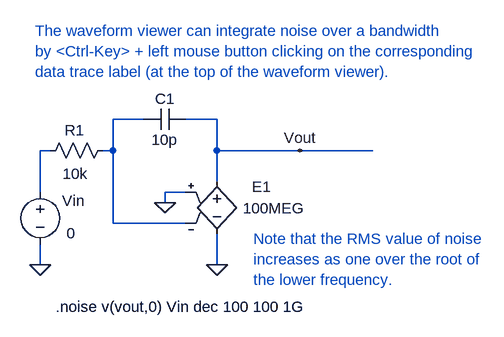
[diagram p0: schematic Ex8_14.asc]
Ex8_14.asc, the LTspice schematic file:
Version 4
SHEET 1 1084 704
WIRE 320 256 320 192
WIRE 320 368 320 336
WIRE 336 192 320 192
WIRE 432 192 416 192
WIRE 432 192 432 144
WIRE 432 304 432 192
WIRE 480 144 432 144
WIRE 512 272 512 256
WIRE 544 256 512 256
WIRE 544 304 432 304
WIRE 592 144 544 144
WIRE 592 192 592 144
WIRE 592 240 592 192
WIRE 592 368 592 320
WIRE 720 192 592 192
WIRE 832 192 720 192
FLAG 592 368 0
FLAG 320 368 0
FLAG 720 192 Vout
FLAG 512 272 0
SYMBOL e 592 224 R0
WINDOW 0 54 24 Left 0
WINDOW 3 40 57 Left 0
SYMATTR InstName E1
SYMATTR Value 100MEG
SYMBOL voltage 320 240 R0
WINDOW 0 34 29 Left 0
WINDOW 3 41 79 Left 0
WINDOW 123 0 0 Left 0
WINDOW 39 0 0 Left 0
SYMATTR InstName Vin
SYMATTR Value 0
SYMBOL res 320 208 R270
WINDOW 0 32 53 VTop 0
WINDOW 3 -4 54 VBottom 0
SYMATTR InstName R1
SYMATTR Value 10k
SYMBOL cap 480 160 R270
WINDOW 0 32 32 VTop 0
WINDOW 3 0 32 VBottom 0
SYMATTR InstName C1
SYMATTR Value 10p
TEXT 344 432 Left 0 !.noise v(vout,0) Vin dec 100 100 1G
TEXT 312 8 Left 0 ;The waveform viewer can integrate noise over a bandwidth \nby <Ctrl-Key> + left mouse button clicking on the corresponding \ndata trace label (at the top of the waveform viewer).
TEXT 648 328 Left 0 ;Note that the RMS value of noise\nincreases as one over the root of\nthe lower frequency.

The netlist it stands for:
* Ex8_14.asc
E1 Vout 0 0 N002 100MEG
Vin N001 0 0
R1 N001 N002 10k
C1 N002 Vout 10p
.noise v(vout,0) Vin dec 100 100 1G
* The waveform viewer can integrate noise over a bandwidth
* by <Ctrl-Key> + left mouse button clicking on the corresponding
* data trace label (at the top of the waveform viewer).
* Note that the RMS value of noise
* increases as one over the root of
* the lower frequency.
.backanno
.end